# EAGLE schematic trial1 (EAGLE 9.6.2)
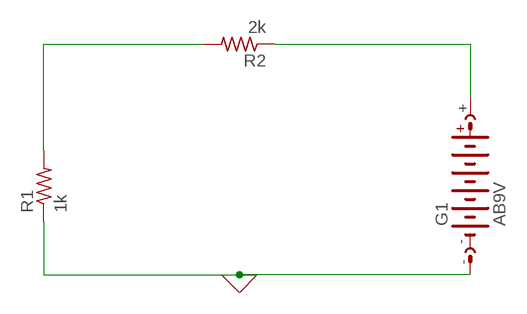
[diagram p0: schematic, sheet 1]

## Parts
G1  AB9V  [AB9V]
R1  1k  R-US_0204/2V  [0204V]
R2  2k  R-US_0204/2V  [0204V]

## Nets
0: G1.- R1.1 ; supply symbol labelled GND
N$1: R1.2 R2.2
N$2: G1.+ R2.1

## Library data of the parts
G1 = battery:AB9V: 9-V BATTERY CLIP
R1 R2 = adafruit:R-US_: RESISTOR, American symbol